# EAGLE design sch1 (EAGLE 7.5.0)
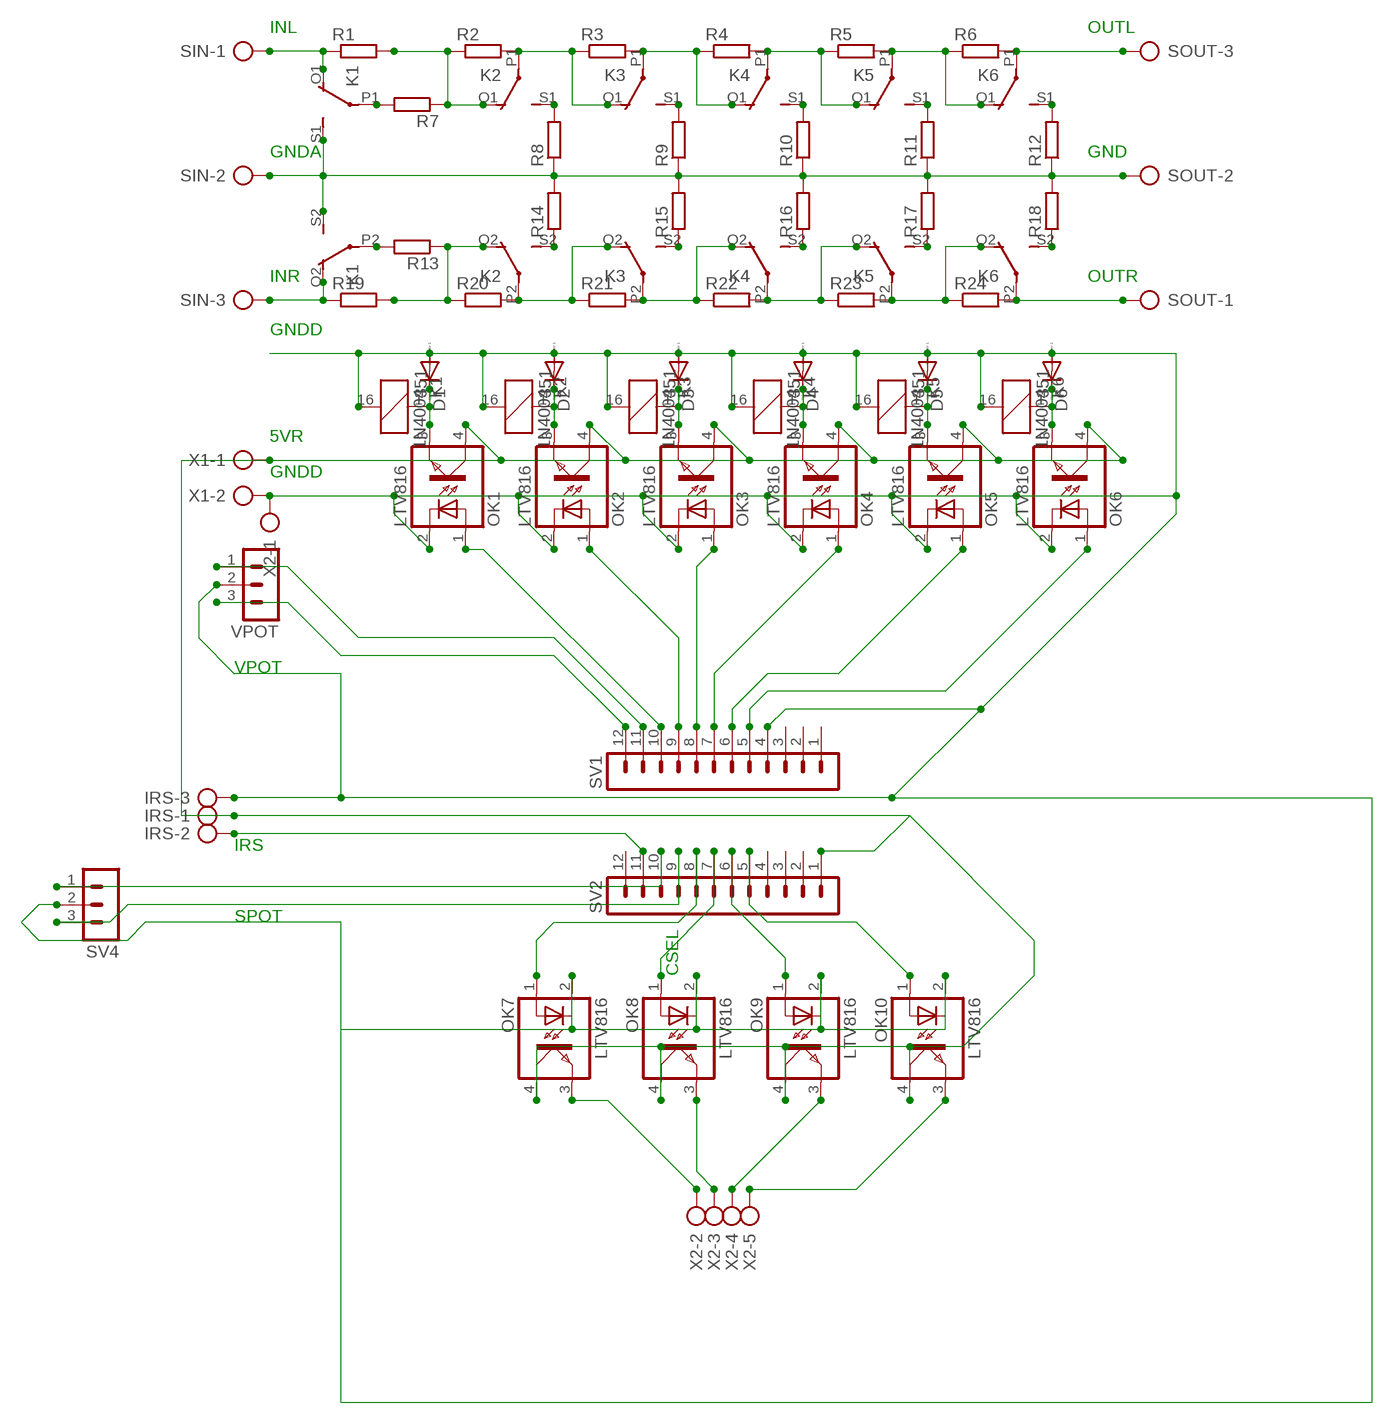
[diagram p0: schematic, sheet 1]

## Parts
D1  1N4004  [DO41-10]
D2  1N4004  [DO41-10]
D3  1N4004  [DO41-10]
D4  1N4004  [DO41-10]
D5  1N4004  [DO41-10]
D6  1N4004  [DO41-10]
IRS  AK500/3  [AK500/3]
K1  351  [351]
K2  351  [351]
K3  351  [351]
K4  351  [351]
K5  351  [351]
K6  351  [351]
OK1  LTV816  [DIL04]
OK2  LTV816  [DIL04]
OK3  LTV816  [DIL04]
OK4  LTV816  [DIL04]
OK5  LTV816  [DIL04]
OK6  LTV816  [DIL04]
OK7  LTV816  [DIL04]
OK8  LTV816  [DIL04]
OK9  LTV816  [DIL04]
OK10  LTV816  [DIL04]
R1  R-EU_0204/7  [0204/7]
R2  R-EU_0204/7  [0204/7]
R3  R-EU_0204/7  [0204/7]
R4  R-EU_0204/7  [0204/7]
R5  R-EU_0204/7  [0204/7]
R6  R-EU_0204/7  [0204/7]
R7  R-EU_0204/7  [0204/7]
R8  R-EU_0204/7  [0204/7]
R9  R-EU_0204/7  [0204/7]
R10  R-EU_0204/7  [0204/7]
R11  R-EU_0204/7  [0204/7]
R12  R-EU_0204/7  [0204/7]
R13  R-EU_0204/7  [0204/7]
R14  R-EU_0204/7  [0204/7]
R15  R-EU_0204/7  [0204/7]
R16  R-EU_0204/7  [0204/7]
R17  R-EU_0204/7  [0204/7]
R18  R-EU_0204/7  [0204/7]
R19  R-EU_0204/7  [0204/7]
R20  R-EU_0204/7  [0204/7]
R21  R-EU_0204/7  [0204/7]
R22  R-EU_0204/7  [0204/7]
R23  R-EU_0204/7  [0204/7]
R24  R-EU_0204/7  [0204/7]
SIN  AK500/3  [AK500/3]
SOUT  AK500/3  [AK500/3]
SV1  MA12-1  [MA12-1]
SV2  MA12-1  [MA12-1]
SV4  MA03-1  [MA03-1]
VPOT  MA03-1  [MA03-1]
X1  AK500/2  [AK500/2]
X2  AK500/5  [AK500/5]

## Nets
GNDA: K1.S1(2:S) K1.S2(3:S) R8.1 R9.1 R10.1 R11.1 R12.1 R14.2 R15.2 R16.2 R17.2 R18.2 SIN.2 SOUT.2
GNDD: D1.A D2.A D3.A D4.A D5.A D6.A IRS.3 K1.16 K2.16 K3.16 K4.16 K5.16 K6.16 OK1.2(C) OK2.2(C) OK3.2(C) OK4.2(C) OK5.2(C) OK6.2(C) OK7.2(C) OK8.2(C) OK9.2(C) OK10.2(C) SV1.4 SV4.2 VPOT.2 X1.2 X2.1
N$1: K2.O1(2:O) R1.2 R2.1 R7.1
N$2: K2.P1(2:P) K3.O1(2:O) R2.2 R3.1
N$3: K3.P1(2:P) K4.O1(2:O) R3.2 R4.1
N$4: K4.P1(2:P) K5.O1(2:O) R4.2 R5.1
N$5: K5.P1(2:P) K6.O1(2:O) R5.2 R6.1
N$6: K6.P1(2:P) R6.2 SOUT.3
N$7: K1.O1(2:O) R1.1 SIN.1
N$8: K1.P2(3:P) R13.2
N$9: K2.S1(2:S) R8.2
N$10: K3.S1(2:S) R9.2
N$11: K4.S1(2:S) R10.2
N$12: K5.S1(2:S) R11.2
N$13: K6.S1(2:S) R12.2
N$14: K1.P1(2:P) R7.2
N$15: K1.O2(3:O) R19.1 SIN.3
N$16: K5.S2(3:S) R17.1
N$17: K4.S2(3:S) R16.1
N$18: K3.S2(3:S) R15.1
N$19: K2.S2(3:S) R14.1
N$20: K6.S2(3:S) R18.1
N$21: OK7.1(A) SV2.8
N$22: SV1.12 VPOT.3
N$23: D1.C K1.1 OK1.3(EMIT)
N$24: D2.C K2.1 OK2.3(EMIT)
N$25: D3.C K3.1 OK3.3(EMIT)
N$26: D4.C K4.1 OK4.3(EMIT)
N$27: D5.C K5.1 OK5.3(EMIT)
N$28: K2.P2(3:P) K3.O2(3:O) R20.2 R21.1
N$29: K3.P2(3:P) K4.O2(3:O) R21.2 R22.1
N$30: K4.P2(3:P) K5.O2(3:O) R22.2 R23.1
N$31: K2.O2(3:O) R13.1 R19.2 R20.1
N$32: K6.P2(3:P) R24.2 SOUT.1
N$33: D6.C K6.1 OK6.3(EMIT)
N$34: K5.P2(3:P) K6.O2(3:O) R23.2 R24.1
N$35: SV1.11 VPOT.1
N$36: OK6.1(A) SV1.5
N$37: OK5.1(A) SV1.6
N$38: OK4.1(A) SV1.7
N$39: OK3.1(A) SV1.8
N$40: OK2.1(A) SV1.9
N$41: OK1.1(A) SV1.10
N$42: SV2.10 SV4.1
N$43: SV2.9 SV4.3
N$44: OK8.1(A) SV2.7
N$45: OK9.1(A) SV2.6
N$46: OK10.1(A) SV2.5
N$49: IRS.2 SV2.11
N$50: IRS.1 OK1.4(COL) OK2.4(COL) OK3.4(COL) OK4.4(COL) OK5.4(COL) OK6.4(COL) OK7.4(COL) OK8.4(COL) OK9.4(COL) OK10.4(COL) SV2.1 X1.1
N$93: OK7.3(EMIT) X2.2
N$94: OK8.3(EMIT) X2.3
N$95: OK9.3(EMIT) X2.4
N$96: OK10.3(EMIT) X2.5
Unconnected: SV1.1 SV1.2 SV1.3 SV2.2 SV2.3 SV2.4 SV2.12

## Notes on the sheet
- INL | OUTL
- GNDA | GND
- INR | OUTR
- GNDD
- 5VR
- GNDD
- VPOT
- IRS
- SPOT
- CSEL

## Library data of the parts
D1-D6 = diode:1N4004: DIODE general purpose rectifier, 1 A
IRS SIN SOUT = con-ptr500:AK500/3: CONNECTOR; OC_FARNELL: unknown; OC_NEWARK: unknown
K1-K6 = relay:351: RELAY 2 x switch, Omron; OC_FARNELL: unknown; OC_NEWARK: unknown
OK1-OK10 = optocoupler:LTV816: OPTO COUPLER Source: LITEON, LTV816.pdf; OC_FARNELL: unknown; OC_NEWARK: unknown
R1-R24 = rcl:R-EU_: RESISTOR, European symbol
SV1 SV2 = con-lstb:MA12-1: PIN HEADER; OC_FARNELL: unknown; OC_NEWARK: unknown
SV4 VPOT = con-lstb:MA03-1: PIN HEADER; OC_FARNELL: unknown; OC_NEWARK: unknown
X1 = con-ptr500:AK500/2: CONNECTOR; OC_FARNELL: unknown; OC_NEWARK: unknown
X2 = con-ptr500:AK500/5: CONNECTOR; OC_FARNELL: unknown; OC_NEWARK: unknown

## Board
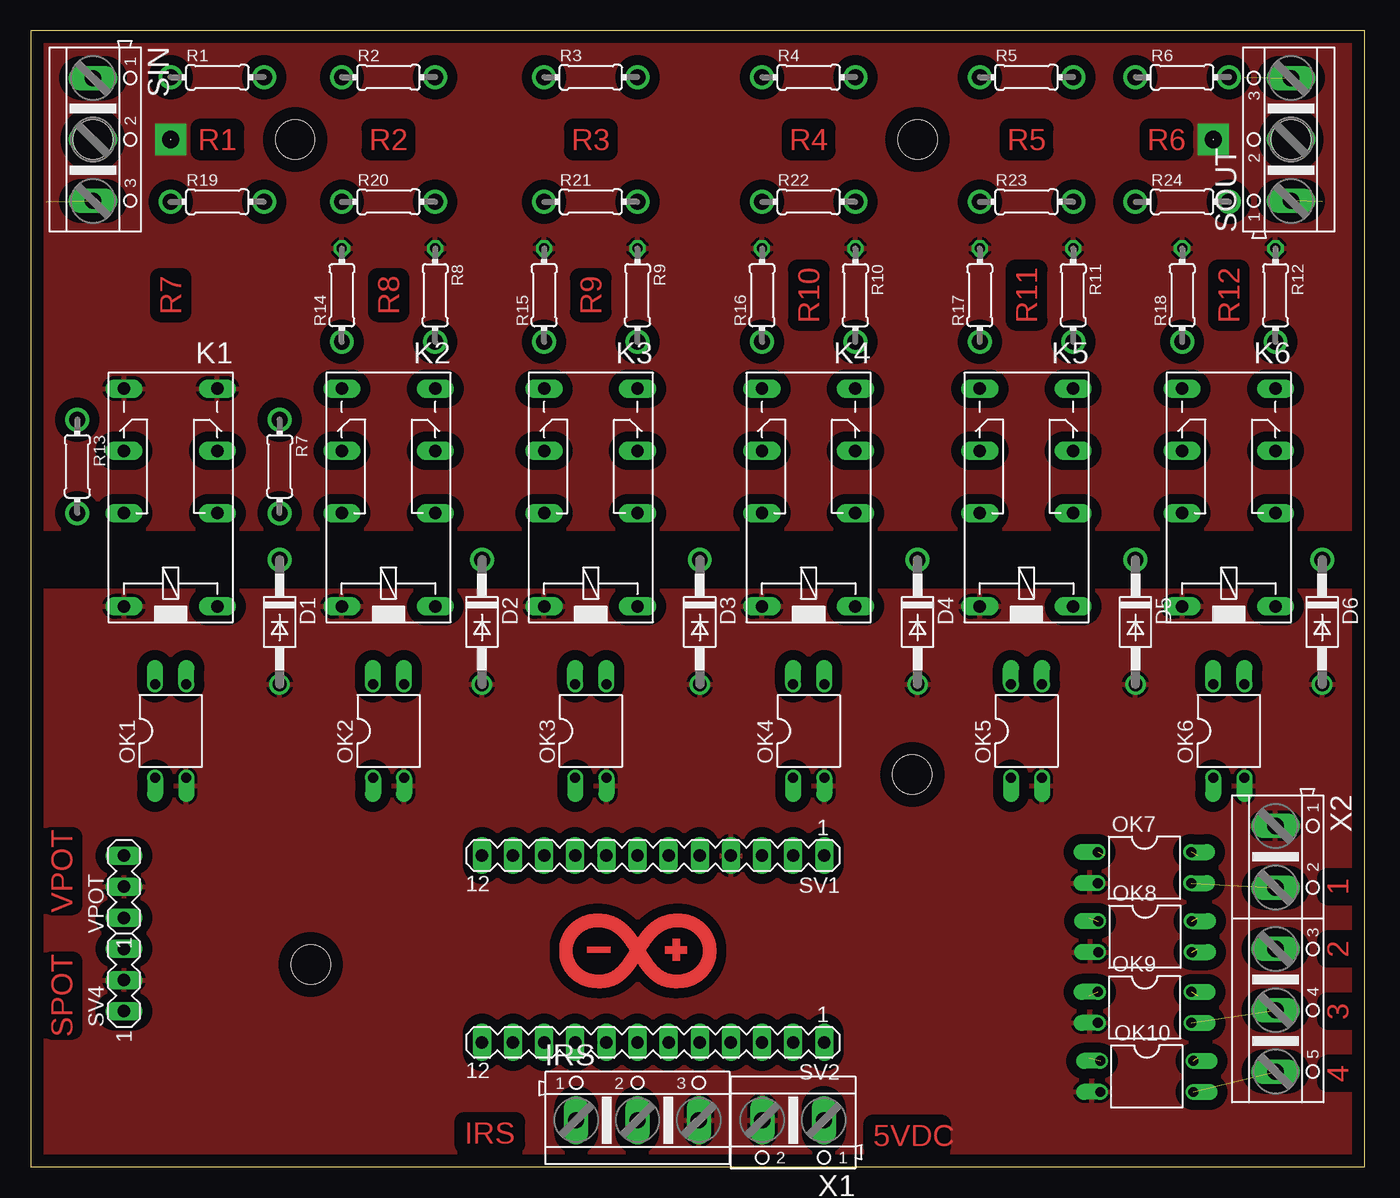
[diagram p1: board, top side]
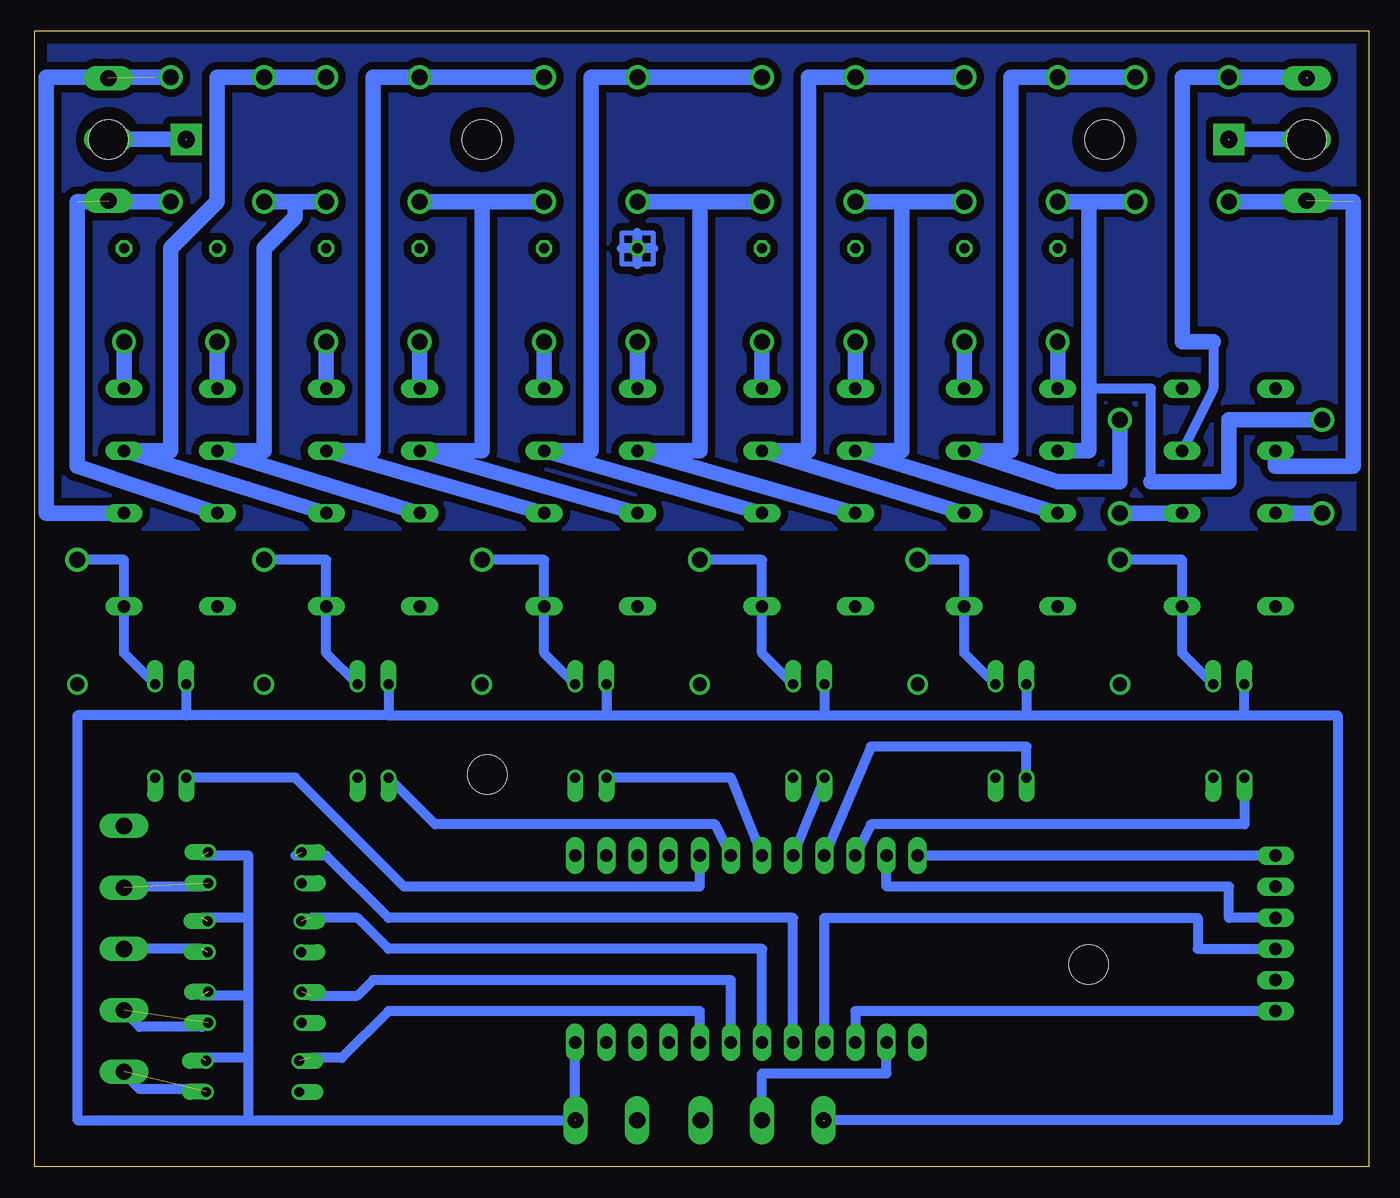
[diagram p2: board, bottom side, seen from below]

Size 108.89 x 92.7 mm. Coordinates in mm from the lower left corner, seen from the top.
Outline: 0,0 108.89,0 108.89,92.7 0,92.7 0,0
Copper layers (1*16): Top 0.035mm / dielectric 1.5mm / Bottom 0.035mm
Design rules "default *": minimum track width 30mil, minimum drill 24mil, track to track 16mil, track to pad 16mil, pad to pad 16mil, via to via 16mil, smd to smd 8mil, copper to edge 40mil, drill to drill 8mil, minimum pad ring 10mil, minimum via ring 8mil, stop-mask expansion 4mil, vias tented up to drill 0mil, thermal gap 10mil
Holes 3.2 mm at 21.59,83.82 72.39,83.82 22.86,16.51 71.96,32.01 5.08,83.82 102.87,83.82
Holes 0 mm at 11.43,83.82 96.52,83.82

### Footprints (pad centres in the part's own frame; a part is rotated, then mirrored left to right if it is on the bottom)
DO41-10 = drill 1.118: A 5.08,0; C -5.08,0
AK500/3 = drill 1.321 long: 1 -5.004,0; 2 0,0; 3 5.004,0
351 = drill 1.016 long: 1 -3.81,-3.81; 16 -3.81,3.81; O1 8.89,-3.81; O2 8.89,3.81; P1 3.81,-3.81; P2 3.81,3.81; S1 13.97,-3.81; S2 13.97,3.81
DIL04 = drill 0.813 offset: 1 -1.27,-3.81; 2 1.27,-3.81; 3 1.27,3.81; 4 -1.27,3.81
0204/7 = drill 0.813 octagon: 1 -3.81,0; 2 3.81,0
MA12-1 = drill 1.016 long: 1 -13.97,0; 2 -11.43,0; 3 -8.89,0; 4 -6.35,0; 5 -3.81,0; 6 -1.27,0; 7 1.27,0; 8 3.81,0; 9 6.35,0; 10 8.89,0; 11 11.43,0; 12 13.97,0
MA03-1 = drill 1.016 long: 1 -2.54,0; 2 0,0; 3 2.54,0
AK500/2 = drill 1.321 long: 1 -2.515,0; 2 2.515,0
AK500/5 = drill 1.321 long: 1 -10.033,0; 2 -5.004,0; 3 0,0; 4 5.004,0; 5 10.008,0

### Placement (x,y rotation side)
D1  20.32,44.45 270 top
D2  36.83,44.45 270 top
D3  54.61,44.45 270 top
D4  72.39,44.45 270 top
D5  90.17,44.45 270 top
D6  105.41,44.45 270 top
IRS  49.53,3.81 0 top
K1  11.43,49.53 90 top
K2  29.21,49.53 90 top
K3  45.72,49.53 90 top
K4  63.5,49.53 90 top
K5  81.28,49.53 90 top
K6  97.79,49.53 90 top
OK1  11.43,35.56 0 top
OK2  29.21,35.56 0 top
OK3  45.72,35.56 0 top
OK4  63.5,35.56 0 top
OK5  81.28,35.56 0 top
OK6  97.79,35.56 0 top
OK7  90.9,24.41 270 top
OK8  90.95,18.78 270 top
OK9  90.92,13.01 270 top
OK10  91.1,7.38 270 top
R1  15.24,88.9 0 top
R2  29.21,88.9 0 top
R3  45.72,88.9 0 top
R4  63.5,88.9 0 top
R5  81.28,88.9 0 top
R6  93.98,88.9 0 top
R7  20.32,57.15 270 top
R8  33.02,71.12 270 top
R9  49.53,71.12 270 top
R10  67.31,71.12 270 top
R11  85.09,71.12 270 top
R12  101.6,71.12 270 top
R13  3.81,57.15 270 top
R14  25.4,71.12 90 top
R15  41.91,71.12 90 top
R16  59.69,71.12 90 top
R17  77.47,71.12 90 top
R18  93.98,71.12 90 top
R19  15.24,78.74 0 top
R20  29.21,78.74 0 top
R21  45.72,78.74 0 top
R22  63.5,78.74 0 top
R23  81.28,78.74 0 top
R24  93.98,78.74 0 top
SIN  5.08,83.82 270 top
SOUT  102.87,83.82 90 top
SV1  50.8,25.4 180 top
SV2  50.8,10.16 180 top
SV4  7.62,15.24 90 top
VPOT  7.62,22.86 90 top
X1  62.23,3.81 180 top
X2  101.6,17.78 270 top

### Tracks (layer width: path | path; a pad name or v marks a point on that pad's centre or on a via)
GNDA  (via drill 1.4 pad 2.54)
  Bottom 1.27: SIN.2 v11.43,83.82 | v96.52,83.82 SOUT.2
  pour Top (isolate 0.813): 0,92.71 109.22,92.71 109.22,52.07 0,52.07
GNDD
  pour Top (isolate 0.813): 0,46.99 109.22,46.99 109.22,0 0,0
N$1
  Bottom 1.27: R1.2 R2.1 29.21,88.9 29.21,58.42 K2.O1 25.4,55.88 20.32,55.88 R7.1
N$2
  Bottom 1.27: R2.2 R3.1 45.72,88.9 45.72,58.42 K3.O1 K2.P1
N$3
  Bottom 1.27: R3.2 R4.1 63.5,88.9 63.5,58.42 K4.O1 K3.P1
N$4
  Bottom 1.27: R4.2 R5.1 81.28,88.9 81.28,58.42 K5.O1 K4.P1
N$5
  Bottom 1.27: R5.2 R6.1 93.98,88.9 93.98,78.74 97.79,74.93 97.79,58.42 K6.O1 K5.P1
N$6  (1 unrouted)
  Bottom 0.813: R6.2 99.06,88.9
  Bottom 1.27: K6.P1 107.95,53.34 107.95,88.9 R6.2
N$7  (1 unrouted)
  Bottom 0.813: 12.7,67.31 12.7,63.5 K1.O1
  Bottom 1.27: 5.08,88.9 R1.1 15.24,88.9 15.24,67.31 12.7,67.31
N$8
  Bottom 1.27: R13.2 K1.P2
N$9
  Bottom 1.27: R8.2 K2.S1
N$10
  Bottom 1.27: R9.2 K3.S1
N$11
  Bottom 1.27: R10.2 K4.S1
N$12
  Bottom 1.27: R11.2 K5.S1
N$13
  Bottom 1.27: R12.2 K6.S1
N$14
  Bottom 1.27: K1.P1 R7.2
N$15  (1 unrouted)
  Bottom 1.27: R19.1 1.27,78.74 1.27,57.15 7.62,57.15 K1.O2
N$16
  Bottom 1.27: R17.1 K5.S2
N$17
  Bottom 1.27: R16.1 K4.S2
N$18
  Bottom 1.27: R15.1 K3.S2
N$19
  Bottom 1.27: R14.1 K2.S2
N$20
  Bottom 1.27: R18.1 K6.S2
N$21  (1 unrouted)
  Bottom 0.813: SV2.8 46.99,20.32 80.01,20.32 85.09,25.4 87.63,25.4
N$22
  Bottom 0.813: VPOT.3 SV1.12
N$23
  Bottom 0.813: OK1.3 15.24,41.91 K1.1 15.24,49.53 D1.C
N$24
  Bottom 0.813: OK2.3 33.02,41.91 K2.1 33.02,49.53 D2.C
N$25
  Bottom 0.813: OK3.3 49.53,41.91 K3.1 49.53,49.53 D3.C
N$26
  Bottom 0.813: OK4.3 67.31,41.91 K4.1 67.31,49.53 D4.C
N$27
  Bottom 0.813: OK5.3 85.09,41.91 K5.1 85.09,49.53 D5.C
N$28
  Bottom 1.27: R20.2 38.1,78.74 | 38.1,78.74 R21.1 | K2.P2 K3.O2 38.1,58.42 38.1,78.74
N$29
  Bottom 1.27: R21.2 54.61,78.74 | 54.61,78.74 R22.1 | K3.P2 K4.O2 54.61,58.42 54.61,78.74
N$30
  Bottom 1.27: R22.2 72.39,78.74 | 72.39,78.74 R23.1 | K4.P2 K5.O2 72.39,58.42 72.39,78.74
N$31
  Bottom 0.813: 17.78,55.88 17.78,63.5 22.86,63.5
  Bottom 1.27: R19.2 22.86,78.74 | 22.86,78.74 R20.1 | 22.86,78.74 22.86,63.5 22.86,58.42 K2.O2 | R13.1 11.43,60.96 11.43,55.88 17.78,55.88
N$32  (1 unrouted)
  Bottom 0.813: R24.2 99.06,78.74
  Bottom 1.27: K6.P2 105.41,57.15 105.41,78.74 R24.2
N$33
  Bottom 0.813: OK6.3 101.6,41.91 K6.1 101.6,49.53 D6.C
N$34
  Bottom 1.27: R23.2 87.63,78.74 | 87.63,78.74 R24.1 | K5.P2 K6.O2 90.17,58.42 90.17,74.93 87.63,77.47 87.63,78.74
N$35
  Bottom 0.813: VPOT.1 11.43,20.32 11.43,22.86 39.37,22.86 SV1.11
N$36
  Bottom 0.813: OK6.1 87.63,31.75 78.74,22.86 54.61,22.86 SV1.5
N$37
  Bottom 0.813: OK5.1 76.2,27.94 53.34,27.94 SV1.6
N$38
  Bottom 0.813: OK4.1 52.07,31.75 SV1.7
N$39
  Bottom 0.813: OK3.1 SV1.8
N$40
  Bottom 0.813: OK2.1 27.94,34.29 40.64,34.29 SV1.9
N$41
  Bottom 0.813: OK1.1 10.16,27.94 40.64,27.94 SV1.10
N$42
  Bottom 0.813: SV4.1 41.91,12.7 SV2.10
N$43
  Bottom 0.813: SV2.9 44.45,20.32 13.97,20.32 13.97,17.78 SV4.3
N$44  (1 unrouted)
  Bottom 0.813: SV2.7 49.53,17.78 80.01,17.78 82.55,20.32 86.36,20.32
N$45  (1 unrouted)
  Bottom 0.813: SV2.6 52.07,15.24 81.28,15.24 82.55,13.97 86.36,13.97
N$46  (1 unrouted)
  Bottom 0.813: SV2.5 54.61,12.7 80.01,12.7 83.82,8.89 86.36,8.89
N$47  (via drill 1.3 pad 1.27)
  other vias: 11.43,88.9
N$48  (via drill 1.3 pad 1.27)
  other vias: 19.05,88.9
N$49
  Bottom 0.813: IRS.2 49.53,7.62 39.37,7.62 SV2.11
N$50  (6 unrouted)
  Bottom 0.813: OK6.4 96.52,36.83 | 96.52,36.83 105.41,36.83 105.41,3.81 91.44,3.81 | 91.44,3.81 64.77,3.81 SV2.1 | OK5.4 80.01,36.83 | 80.01,36.83 96.52,36.83 | 80.01,36.83 62.23,36.83 | 62.23,36.83 44.45,36.83 | 44.45,36.83 27.94,36.83 | 27.94,36.83 10.16,36.83 | 10.16,36.83 OK1.4 | OK2.4 27.94,36.83 | OK3.4 44.45,36.83 | OK4.4 62.23,36.83 | 10.16,36.83 2.54,36.83 2.54,3.81 44.45,3.81 | 91.44,3.81 91.44,8.89 | 91.44,8.89 91.44,13.97 | 91.44,13.97 91.44,20.32 | 91.44,20.32 91.44,25.4 95.25,25.4 | 91.44,20.32 95.25,20.32 | 91.44,13.97 95.25,13.97 | 91.44,8.89 95.25,8.89
N$51  (via drill 1.3 pad 1.27)
  other vias: 25.4,88.9
N$52  (via drill 1.3 pad 1.27)
  other vias: 33.02,88.9
N$53  (via drill 1.3 pad 1.27)
  other vias: 41.91,88.9
N$54  (via drill 1.3 pad 1.27)
  other vias: 49.53,88.9
N$55  (via drill 1.3 pad 1.27)
  other vias: 59.69,88.9
N$56  (via drill 1.3 pad 1.27)
  other vias: 67.31,88.9
N$57  (via drill 1.3 pad 1.27)
  other vias: 77.47,88.9
N$58  (via drill 1.3 pad 1.27)
  other vias: 11.43,78.74
N$59  (via drill 1.3 pad 1.27)
  other vias: 19.05,78.74
N$60  (via drill 1.3 pad 1.27)
  other vias: 25.4,78.74
N$61  (via drill 1.3 pad 1.27)
  other vias: 33.02,78.74
N$62  (via drill 1.3 pad 1.27)
  other vias: 41.91,78.74
N$63  (via drill 1.3 pad 1.27)
  other vias: 49.53,78.74
N$64  (via drill 1.3 pad 1.27)
  other vias: 59.69,78.74
N$65  (via drill 1.3 pad 1.27)
  other vias: 67.31,78.74
N$66  (via drill 1.3 pad 1.27)
  other vias: 77.47,78.74
N$67  (via drill 1.3 pad 1.27)
  other vias: 85.09,78.74
N$68  (via drill 1.3 pad 1.27)
  other vias: 90.17,78.74
N$69  (via drill 1.3 pad 1.27)
  other vias: 85.09,88.9
N$70  (via drill 1.3 pad 1.27)
  other vias: 90.17,88.9
N$71  (via drill 1.3 pad 1.27)
  other vias: 97.79,88.9
N$72  (via drill 1.3 pad 1.27)
  other vias: 97.79,78.74
N$73  (via drill 1.3 pad 1.27)
  other vias: 3.81,60.96
N$74  (via drill 1.3 pad 1.27)
  other vias: 3.81,53.34
N$75  (via drill 1.3 pad 1.27)
  other vias: 20.32,53.34
N$76  (via drill 1.3 pad 1.27)
  other vias: 20.32,60.96
N$77  (via drill 1.3 pad 1.27)
  other vias: 25.4,67.31
N$78  (via drill 1.3 pad 1.27)
  other vias: 33.02,67.31
N$79  (via drill 1.3 pad 1.27)
  other vias: 41.91,67.31
N$80  (via drill 1.3 pad 1.27)
  other vias: 49.53,67.31
N$81  (via drill 1.3 pad 1.27)
  other vias: 59.69,67.31
N$82  (via drill 1.3 pad 1.27)
  other vias: 67.31,67.31
N$83  (via drill 1.3 pad 1.27)
  other vias: 77.47,67.31
N$84  (via drill 1.3 pad 1.27)
  other vias: 85.09,67.31
N$85  (via drill 1.3 pad 1.27)
  other vias: 93.98,67.31
N$86  (via drill 1.3 pad 1.27)
  other vias: 101.6,67.31
N$87  (via drill 1.3 pad 1.27)
  other vias: 20.32,49.53
N$88  (via drill 1.3 pad 1.27)
  other vias: 36.83,49.53
N$89  (via drill 1.3 pad 1.27)
  other vias: 54.61,49.53
N$90  (via drill 1.3 pad 1.27)
  other vias: 72.39,49.53
N$91  (via drill 1.3 pad 1.27)
  other vias: 90.17,49.53
N$92  (via drill 1.3 pad 1.27)
  other vias: 105.41,49.53
N$93  (1 unrouted)
N$94  (1 unrouted)
  Bottom 0.813: 95.25,17.78 X2.3
N$95  (1 unrouted)
N$96  (1 unrouted)
N$106
  Bottom 0.813: 95.25,22.86 101.6,22.86
N$107
  Bottom 0.813: 95.25,11.43 100.33,11.43 101.6,12.7
N$108
  Bottom 0.813: 95.25,6.35 100.33,6.35 101.6,7.62
N$109
  pour Bottom (isolate 0.61): 0,92.71 0,52.07 109.22,52.07 109.22,92.71
N$110
  Bottom 0.406: 59.69,76.2 58.42,76.2 58.42,74.93 58.42,73.66 59.69,73.66 60.96,73.66 60.96,74.93 60.96,76.2 59.69,76.2
  Bottom 0.813: 59.69,73.66 59.69,76.2 | 58.42,74.93 60.96,74.93
(copper drawn outside any net)
  shapes: Top area x1133

### Text on the board
Top: R1 | R2 | R3 | R4 | R5 | R6 | R7 | R8 | R9 | R10 | R11 | R12 | VPOT | 1 | 2 | SPOT | 3 | 4 | IRS | 5VDC
200bmp: C:/Users/l0014/Desktop/Arduino_Logo.bmp